# Altium schematic sheet fullCURRENT smarts comms.SchDoc
size C
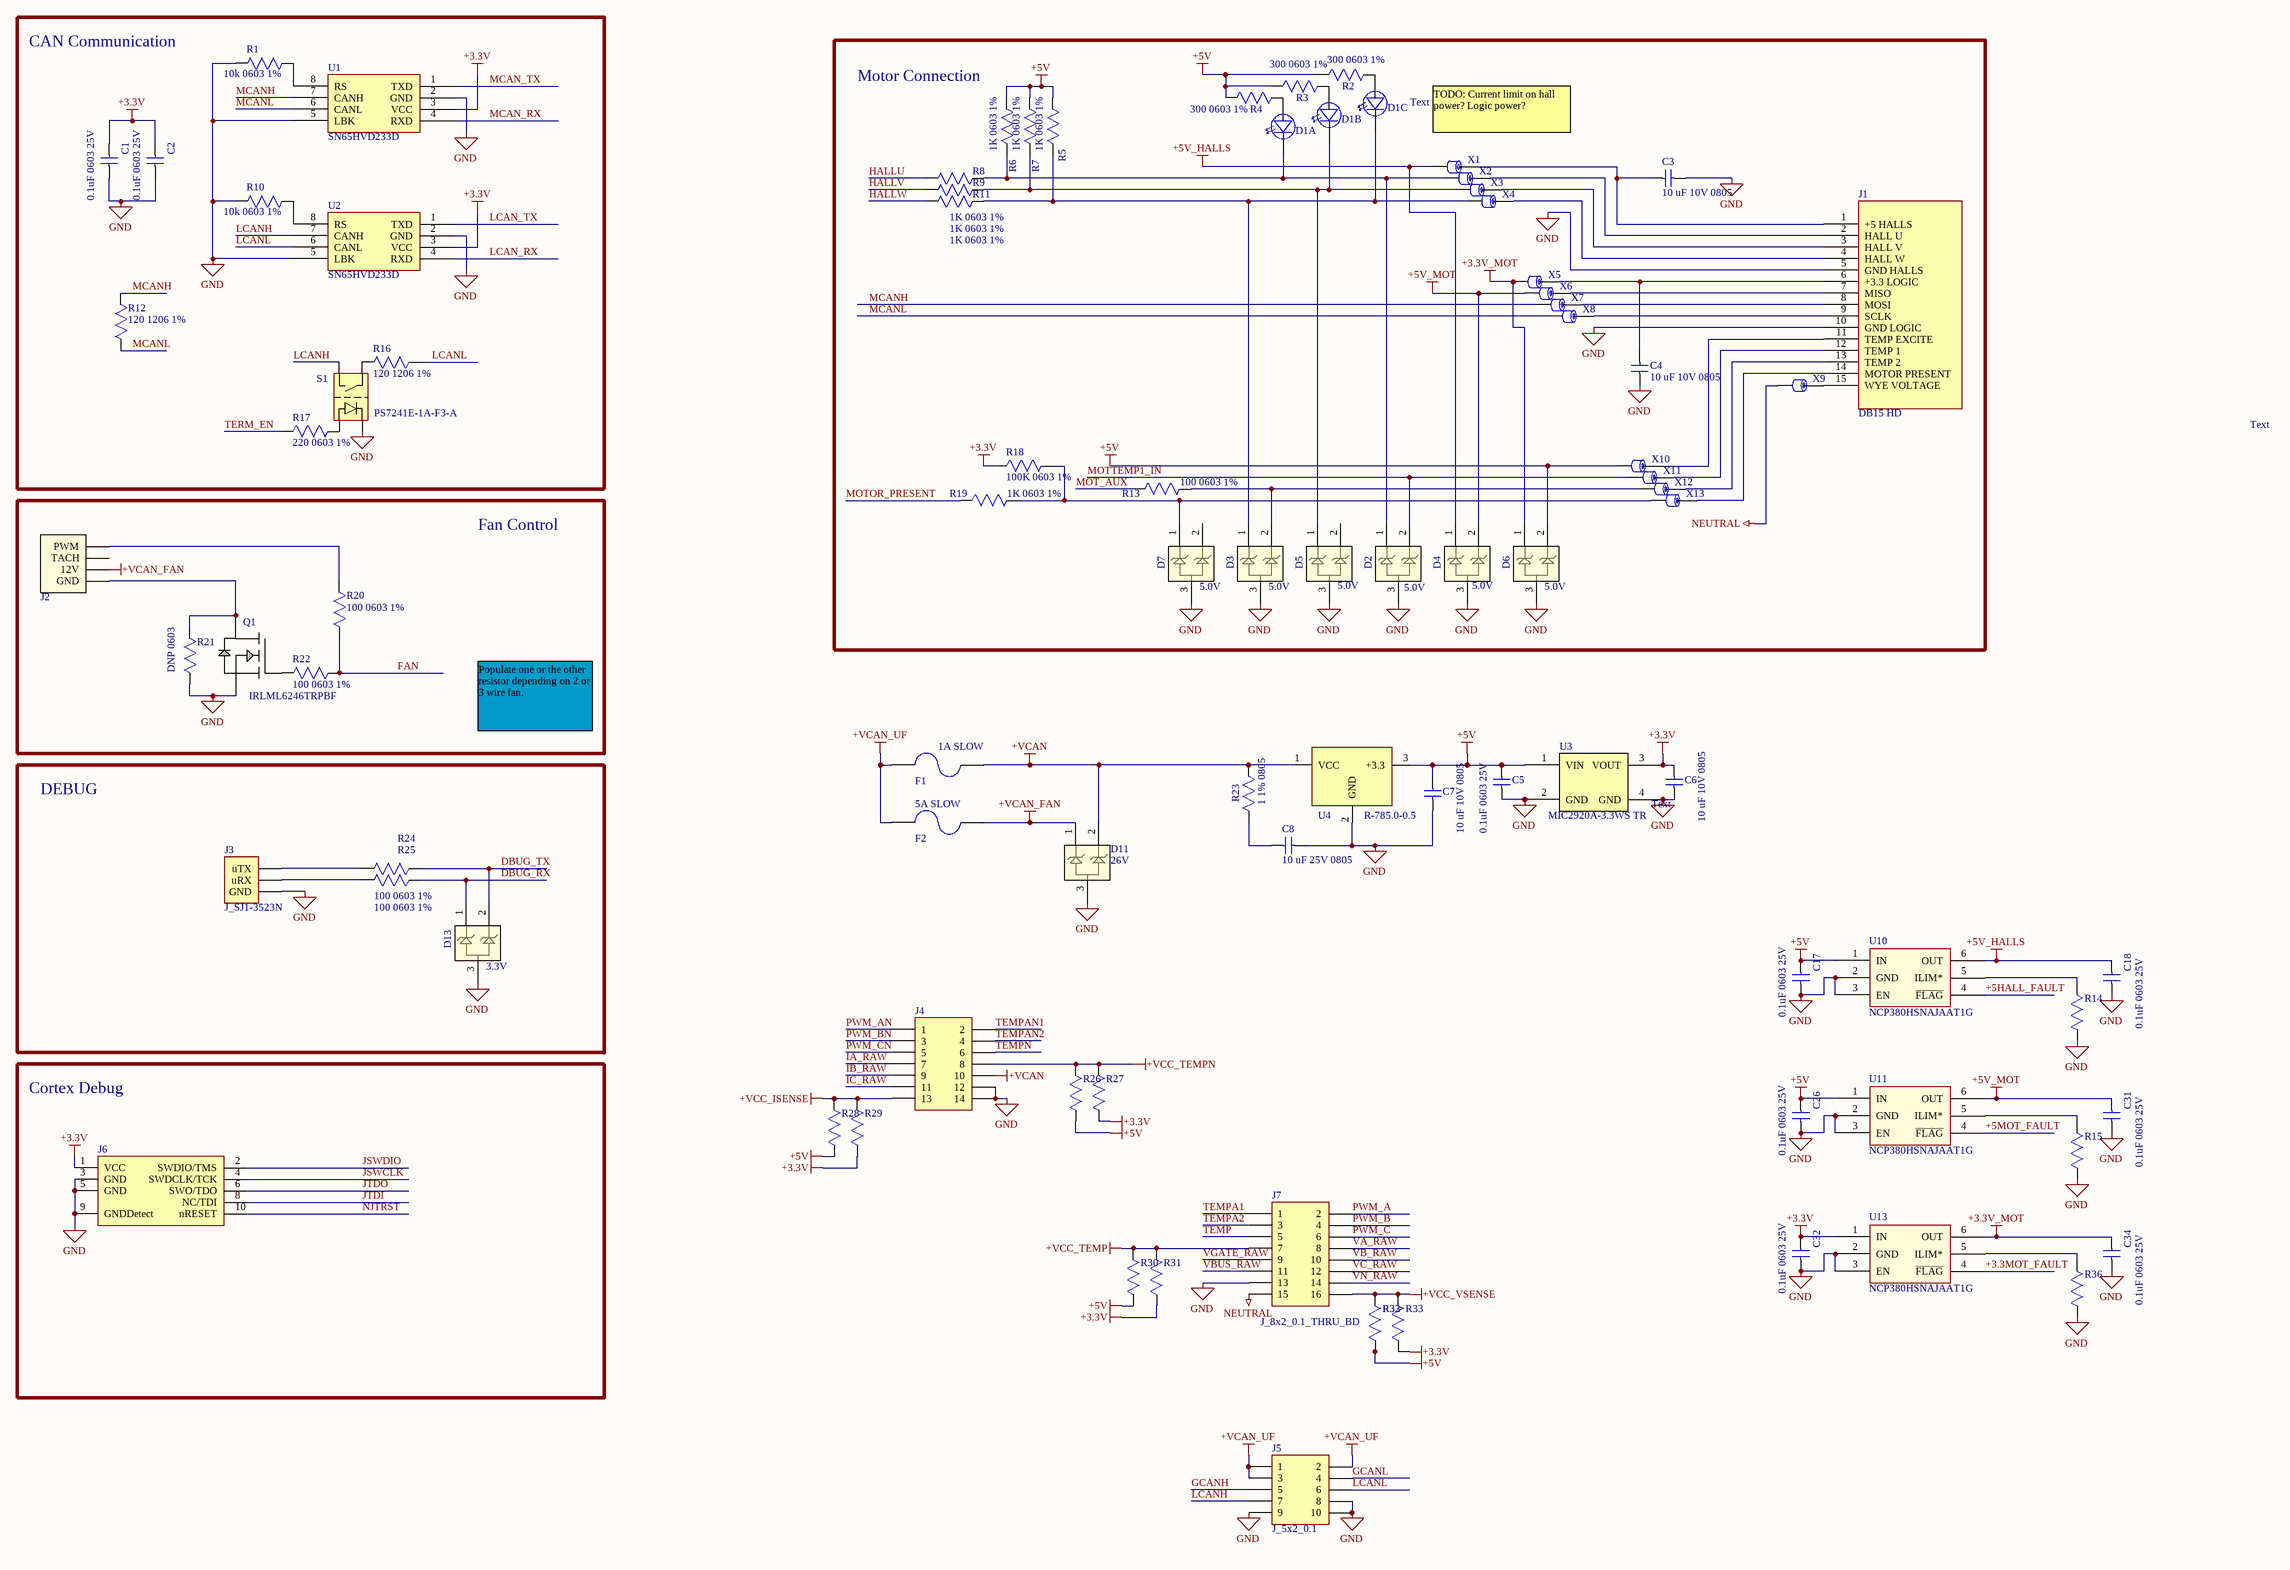
[diagram p0: fullCURRENT smarts comms.SchDoc]

## Parts
(Parts that share a designator on the sheet are numbered #1, #2 ... from top to bottom, then left to right.)
C1  value 0.1uF 0603 25V  [0603_cap]  (hidden comment: CAP 0603)
C2  value 0.1uF 0603 25V  [0603_cap]  (hidden comment: CAP 0603)
C3  value 10 uF 10V 0805  [0805_Capacitor]  (hidden comment: CAP 0805)
C4  value 10 uF 10V 0805  [0805_Capacitor]  (hidden comment: CAP 0805)
C5  value 0.1uF 0603 25V  [0603_cap]  (hidden comment: CAP 0603)
C6  value 10 uF 10V 0805  [0805_Capacitor]  (hidden comment: CAP 0805)
C7  value 10 uF 10V 0805  [0805_Capacitor]  (hidden comment: CAP 0805)
C8  value 10 uF 25V 0805  [0805_Capacitor]  (hidden comment: CAP 10 uF 25V 0805)
C17  value 0.1uF 0603 25V  [0603_cap]  (hidden comment: CAP 0603)
C18  value 0.1uF 0603 25V  [0603_cap]  (hidden comment: CAP 0603)
C26  value 0.1uF 0603 25V  [0603_cap]  (hidden comment: CAP 0603)
C31  value 0.1uF 0603 25V  [0603_cap]  (hidden comment: CAP 0603)
C32  value 0.1uF 0603 25V  [0603_cap]  (hidden comment: CAP 0603)
C34  value 0.1uF 0603 25V  [0603_cap]  (hidden comment: CAP 0603)
D1  D_LED_3HIGH_BLUE  [DIALIGHT 564]  (value not drawn)  (parts A,B,C of 3)
D2  5.0V  [SOT-23]
D3  5.0V  [SOT-23]
D4  5.0V  [SOT-23]
D5  5.0V  [SOT-23]
D6  5.0V  [SOT-23]
D7  5.0V  [SOT-23]
D11  26V  [SOT-23]
D13  3.3V  [SOT-23]
F1  Current Rating: 1A SLOW  [2410]  (hidden comment: F_2410)
F2  Current Rating: 5A SLOW  [2410]  (hidden comment: F_2410)
J1  DB15 HD  [DB15HDF_RA]
J2  J_4 Wire Fan Connector  [0901361204]  (value not drawn)
J3  J_SJ1-3523N  [SJ1-3523N]
J4  J_7x2_0.1_THRU_BD  [HLE-107-02-X-DV]  (value not drawn)
J5  J_5x2_0.1  [10PIN_2_.100IN]
J6  J_CORTEX_DEBUG  [CORTEX_DEBUG]  (value not drawn)
J7  J_8x2_0.1_THRU_BD  [HLE-108-02-X-DV]
Q1  Part Number: IRLML6246TRPBF  [SOT-23]  (hidden comment: Q_IRLML6246TRPBF)
R1  value 10k 0603 1%  [0603_res]  (hidden comment: RES 0603)
R2  value 300 0603 1%  [0603_res]  (hidden comment: RES 0603)
R3  value 300 0603 1%  [0603_res]  (hidden comment: RES 0603)
R4  value 300 0603 1%  [0603_res]  (hidden comment: RES 0603)
R5  value 1K 0603 1%  [0603_res]  (hidden comment: RES 0603)
R6  value 1K 0603 1%  [0603_res]  (hidden comment: RES 0603)
R7  value 1K 0603 1%  [0603_res]  (hidden comment: RES 0603)
R8  value 1K 0603 1%  [0603_res]  (hidden comment: RES 0603)
R9  value 1K 0603 1%  [0603_res]  (hidden comment: RES 0603)
R10  value 10k 0603 1%  [0603_res]  (hidden comment: RES 0603)
R11  value 1K 0603 1%  [0603_res]  (hidden comment: RES 0603)
R12  value 120 1206 1%  [1206_Resistor]  (hidden comment: RES 1206)
R13  value 100 0603 1%  [0603_res]  (hidden comment: RES 0603)
R14  RES 0603  [0603_res]  (value not drawn)
R15  RES 0603  [0603_res]  (value not drawn)
R16  value 120 1206 1%  [1206_Resistor]  (hidden comment: RES 1206)
R17  value 220 0603 1%  [0603_res]  (hidden comment: RES 0603)
R18  value 100K 0603 1%  [0603_res]  (hidden comment: RES 0603)
R19  value 1K 0603 1%  [0603_res]  (hidden comment: RES 0603)
R20  value 100 0603 1%  [0603_res]  (hidden comment: RES 0603)
R21  value DNP 0603  [0603_res]  (hidden comment: RES 0603)
R22  value 100 0603 1%  [0603_res]  (hidden comment: RES 0603)
R23  value 1 1% 0805  [0805_Resistor]  (hidden comment: R_0805_1_1%)
R24  value 100 0603 1%  [0603_res]  (hidden comment: RES 0603)
R25  value 100 0603 1%  [0603_res]  (hidden comment: RES 0603)
R26  RES 0603  [0603_res]  (value not drawn)
R27  RES 0603  [0603_res]  (value not drawn)
R28  RES 0603  [0603_res]  (value not drawn)
R29  RES 0603  [0603_res]  (value not drawn)
R30  RES 0603  [0603_res]  (value not drawn)
R31  RES 0603  [0603_res]  (value not drawn)
R32  RES 0603  [0603_res]  (value not drawn)
R33#1  RES 0603  [0603_res]  (value not drawn)
R33#2  RES 0603  [0603_res]  (value not drawn)
R36  RES 0603  [0603_res]  (value not drawn)
S1  Part Number: PS7241E-1A-F3-A  [4SOP-GULL]  (hidden comment: S_PS7241E-1A-F3-A)
U1  Part Number: SN65HVD233D  [SOIC127P600X175-8N]  (hidden comment: U_SN65HVD233D)
U2  Part Number: SN65HVD233D  [SOIC127P600X175-8N]  (hidden comment: U_SN65HVD233D)
U3  Part Number: MIC2920A-3.3WS TR  [SOT-223]  (hidden comment: U_MIC2920A-3.3WS)
U4  R-785.0-0.5  [SIP3]
U10  NCP380HSNAJAAT1G  [tsop-6]
U11  NCP380HSNAJAAT1G  [TSOP-6]
U13  NCP380HSNAJAAT1G  [TSOP-6]
X1  0603  [0603_res]  (value not drawn)
X2  0603  [0603_res]  (value not drawn)
X3  0603  [0603_res]  (value not drawn)
X4  0603  [0603_res]  (value not drawn)
X5  0603  [0603_res]  (value not drawn)
X6  0603  [0603_res]  (value not drawn)
X7  0603  [0603_res]  (value not drawn)
X8  0603  [0603_res]  (value not drawn)
X9  0603  [0603_res]  (value not drawn)
X10  0603  [0603_res]  (value not drawn)
X11  0603  [0603_res]  (value not drawn)
X12  0603  [0603_res]  (value not drawn)
X13  0603  [0603_res]  (value not drawn)

## Blocks framed on the sheet
CAN Communication: C1 C2 R1 R10 R12 R16 R17 S1 U1 U2
Motor Connection: C3 C4 D1-D7 J1 R2-R9 R11 R13 R18 R19 X1-X13
Fan Control: J2 Q1 R20-R22
DEBUG: D13 J3 R24 R25
Cortex Debug: J6

## Nets
+3.3V: C1.2 C2.2 C6.2 C32.2 J6.1(VCC) R18.2 R27.1 R29.1 R31.1 R33#2.1 U1.3(VCC) U2.3(VCC) U3.3(VOUT) U13.1(IN)
+3.3V_MOT: C34.2 D6.1 U13.6(OUT) X5.1
+5V: C5.2 C7.2 C17.2 C26.2 D6.2 R2.2 R3.2 R4.2 R5.1 R6.1 R7.1 R26.1 R28.1 R30.1 R32.1 R33#1.1 U3.1(VIN) U4.3(+3.3) U10.1(IN) U11.1(IN) X10.1
+5V_HALLS: C18.2 D4.1 U10.6(OUT) X1.1
+5V_MOT: C31.2 D4.2 U11.6(OUT) X6.1
+VCAN: D11.2 F1.2 J4.10 R23.1 U4.1(VCC)
+VCAN_FAN: D11.1 F2.2 J2.2(12V)
+VCAN_UF: F1.1 F2.1 J5.1 J5.2 J5.3
+VCC_ISENSE: J4.13 R28.2 R29.2
+VCC_TEMP: J7.7 R30.2 R31.2
+VCC_TEMPN: J4.8 R26.2 R27.2
+VCC_VSENSE: J7.16 R32.2 R33#1.2 R33#2.2
GND: C1.1 C2.1 C3.2 C4.2 C5.1 C6.1 C7.1 C8.2 C17.1 C18.1 C26.1 C31.1 C32.1 C34.1 D2.3 D3.3 D4.3 D5.3 D6.3 D7.3 D11.3 D13.3 J1.5(GND_HALLS) J1.10(GND_LOGIC) J3.GND J4.12 J4.14 J5.8 J5.9 J5.10 J6.3(GND) J6.5(GND) J6.9(GNDDetect) J7.13 Q1.2(SOURCE) R1.1 R10.1 R14.1 R15.1 R21.2 R36.1 S1.2 U1.2(GND) U1.5(LBK) U2.2(GND) U2.5(LBK) U3.2(GND) U3.4(GND) U4.2(GND) U10.2(GND) U10.3(EN) U11.2(GND) U11.3(EN) U13.2(GND) U13.3(EN)
NEUTRAL: J7.15 X9.1
+3.3MOT_FAULT: U13.4(~{FLAG})
+5HALL_FAULT: U10.4(~{FLAG})
+5MOT_FAULT: U11.4(~{FLAG})
DBUG_RX: D13.1 R25.2
DBUG_TX: D13.2 R24.2
FAN: R20.2 R22.2
GCANH: J5.5
GCANL: J5.4
HALLU: R8.1
HALLV: R9.1
HALLW: R11.1
IA_RAW: J4.7
IB_RAW: J4.9
IC_RAW: J4.11
JSWCLK: J6.4(SWDCLK/TCK)
JSWDIO: J6.2(SWDIO/TMS)
JTDI: J6.8(NC/TDI)
JTDO: J6.6(SWO/TDO)
LCAN_RX: U2.4(RXD)
LCAN_TX: U2.1(TXD)
LCANH: J5.7 S1.4 U2.7(CANH)
LCANL: J5.6 R16.2 U2.6(CANL)
MCAN_RX: U1.4(RXD)
MCAN_TX: U1.1(TXD)
MCANH: R12.1 U1.7(CANH) X7.1
MCANL: R12.2 U1.6(CANL) X8.1
MOT_AUX: R13.2
MOTOR_PRESENT: R19.2
MOTTEMP1_IN: D2.2 X11.1
NJTRST: J6.10(nRESET)
PWM_A: J7.2
PWM_AN: J4.1
PWM_B: J7.4
PWM_BN: J4.3
PWM_C: J7.6
PWM_CN: J4.5
TEMP: J7.5
TEMPA1: J7.1
TEMPA2: J7.3
TEMPAN1: J4.2
TEMPAN2: J4.4
TEMPN: J4.6
TERM_EN: R17.2
VA_RAW: J7.8
VB_RAW: J7.10
VBUS_RAW: J7.11
VC_RAW: J7.12
VGATE_RAW: J7.9
VN_RAW: J7.14
NetC3_1: C3.1 J1.1(+5_HALLS) X1.2
NetC4_1: C4.1 J1.6(+3.3_LOGIC) X5.2
NetC8_1: C8.1 R23.2
NetD1_1: D1.1(Cathode) D2.1 R6.2 R8.2 X2.1
NetD1_2: D1.2(Anode) R4.1
NetD1_3: D1.3(Cathode) D5.1 R7.2 R9.2 X3.1
NetD1_4: D1.4(Anode) R3.1
NetD1_5: D1.5(Cathode) D3.1 R5.2 R11.2 X4.1
NetD1_6: D1.6(Anode) R2.1
NetD3_2: D3.2 R13.1 X12.1
NetD7_1: D7.1 R18.1 R19.1 X13.1
NetJ1_2: J1.2(HALL_U) X2.2
NetJ1_3: J1.3(HALL_V) X3.2
NetJ1_4: J1.4(HALL_W) X4.2
NetJ1_7: J1.7(MISO) X6.2
NetJ1_8: J1.8(MOSI) X7.2
NetJ1_9: J1.9(SCLK) X8.2
NetJ1_11: J1.11(TEMP_EXCITE) X10.2
NetJ1_12: J1.12(TEMP_1) X11.2
NetJ1_13: J1.13(TEMP_2) X12.2
NetJ1_14: J1.14(MOTOR_PRESENT) X13.2
NetJ1_15: J1.15(WYE_VOLTAGE) X9.2
NetJ2_1: J2.1(GND) Q1.3(DRAIN) R21.1
NetJ2_4: J2.4(PWM) R20.1
NetJ3_uRX: J3.uRX R25.1
NetJ3_uTX: J3.uTX R24.1
NetQ1_1: Q1.1(GATE) R22.1
NetR1_2: R1.2 U1.8(RS)
NetR10_2: R10.2 U2.8(RS)
NetR14_2: R14.2 U10.5(ILIM*)
NetR15_2: R15.2 U11.5(ILIM*)
NetR16_1: R16.1 S1.3
NetR17_1: R17.1 S1.1
NetR36_2: R36.2 U13.5(ILIM*)

Not connected (* = marked no-connect by the designer): D5 2; D7 2; J2 3(TACH)

## Notes on the sheet
- Text
- TODO: Current limit on hall power? Logic power?
- Populate one or the other resistor depending on 2 or 3 wire fan.
- (near C6) Text

## Library data of the parts
C1 C2 C5 C17 C18 C26 C31 C32 C34 = C_0603: CAP CERM 0.1uF 0603 X7R; Supplier 1: Digi-Key; Supplier Part Number 1: 490-1524-1-ND
  C5: Known Distributors: Digikey; Package: 0603
C3 C4 C6 C7 = C_0805: CAP CERM 0805; Supplier 1: Digi-Key; Supplier Part Number 1: 587-1300-1-ND
C8 = C_0805: CAP CERM 10 uF 25V 0805; Supplier 1: Digi-Key; Supplier Part Number 1: 587-2985-2-ND
D1 = D_LED_3HIGH_BLUE: LED 3MM TRI-LEVEL HI-EFF BLUE; Part Number: 564-0100-999F; Manufacturer: Dialight; Supplier 1: Digi-Key; Supplier Part Number 1: 350-1852-ND
D2 D3 D6 D7 = D_TVS_5: 5.0V TVS SOT23; Supplier 1: Digi-Key; Supplier Part Number 1: 641-1198-1-ND
D4 D5 = D_TVS_3_3: 5.0V TVS SOT23; Supplier 1: Digi-Key; Supplier Part Number 1: 641-1198-1-ND
D11 = D_TVS_12V: Supplier 1: Digi-Key; Supplier Part Number 1: MMBZ33VAL-FDICT-ND
D13 = D_TVS_5: 3.3V TVS SOT23; Supplier 1: Digi-Key
F1 F2 = F_2410: FUSE 2410; Package: 2410; Supplier 1: Digi-Key
  F1: Supplier Part Number 1: 507-1186-1-ND
  F2: Supplier Part Number 1: 507-1194-1-ND
J1 = J_DB15_HD_F_RA_MOTOR: Supplier 1: Digi-Key; Supplier Part Number 1: A35116-ND
J2 = J_4 Wire Fan Connector: 4 Wire Fan Connector; Supplier 1: Digi-Key; Part Number: 0901361204
J3 = J_SJ1-3523N: CONN JACK STEREO R/A 3PIN 3.5MM; Manufacturer: CUI; Part Number: SJ1-3523N
J4 = J_7x2_0.1_THRU_BD: 7 x 2 0.1" Header; Part Number: HLE-107-02-L-DV-BE; Manufacturer: Samtec; Supplier Part Number 1: HLE-107-02-L-DV-BE; Supplier 1: Samtec
J5 = J_5x2_0.1: 5 x 2 0.1" Header; Part Number: TST-105-01-F-D; Manufacturer: Samtec; Supplier 1: Digi-Key; Supplier Part Number 1: S9169-ND
J6 = J_CORTEX_DEBUG: CORTEX JTAG DEBUG CONNECTOR; Part Number: FTSH-105-01-F-D; Manufacturer: Samtec; Supplier 1: Samtec; Supplier Part Number 1: FTSH-105-01-F-D
J7 = J_8x2_0.1_THRU_BD: 8 x 2 0.1" Header; Part Number: HLE-108-02-F-DV-PE-BE; Manufacturer: Samtec; Supplier Part Number 1: HLE-108-02-F-DV-PE-BE; Supplier 1: Samtec
Q1 = Q_IRLML6246TRPBF: MOSFET N-CH 20V 4.1A SOT-23; Manufacturer: Alpha & Omega; Supplier 1: Digi-Key; Supplier Part Number 1: IRLML6246TRPBFCT-ND
R1 R10 = R_0603: RES 10K 0603 1%; Supplier 1: Digi-Key; Supplier Part Number 1: 311-10.0KHRCT-ND
R2-R4 = R_0603: RES 300 0603 1%; Supplier 1: Digi-Key; Supplier Part Number 1: 311-300HRCT-ND
R5-R9 R11 R19 = R_0603: RES 1K 0603 1%; Supplier 1: Digi-Key; Supplier Part Number 1: 311-1.00KHRCT-ND
R12 R16 = R_1206: RES 120 1206 1%; Package: 1206; Supplier 1: Digi-Key; Supplier Part Number 1: 311-120FRCT-ND
R13 R20 R22 R24 R25 = R_0603: RES 100 0603 1%; Supplier 1: Digi-Key
  R13 R20 R22: Supplier Part Number 1: 311-100HRCT-ND
R14 R15 R26-R32 R33#1 R33#2 R36 = R_0603: Known Distributors: Digikey; Package: 0603
R17 = R_0603: RES 220 0603 1%; Manufacturer: Yageo; Part Number: RC0603FR-07220RL; Package: 0603; Supplier 1: Digi-Key; Supplier Part Number 1: 311-220GRCT-ND
R18 = R_0603: RES 100K 0603 1%; Supplier 1: Digi-Key; Supplier Part Number 1: 311-100KHRCT-ND
R21 = R_0603: RES DNP 0603 1%
R23 = R_0805_1_1%: RES 1 OHM 1/8W 1% 0805 SMD; Power Rating: .125W; Package: 0805; Supplier 1: Digi-Key; Supplier Part Number 1: RHM1.00CICT-ND
S1 = S_PS7241E-1A-F3-A: SSR OCMOS FET 120MA 1CH NO 4-SOP; Manufacturer: CEL; Supplier 1: Digi-Key; Supplier Part Number 1: PS7241E-1ACT-ND
U1 U2 = U_SN65HVD233D: IC 3.3V CAN TXRX 8-SOIC; Manufacturer: Texas Instruments; Supplier 1: Digi-Key; Supplier Part Number 1: 296-14639-5-ND
U3 = U_MIC2920A-3.3WS: IC REG LDO 3.3V .4A SOT223; Manufacturer: Mircrel; Supplier 1: Digi-Key; Supplier Part Number 1: 576-1116-1-ND
U4 = U_R-783.3-0.5: IC REG 0.5A 5.0V; Manufacturer: Recom Power; Part Number: R-785.0-0.5; Supplier 1: Digi-Key; Supplier Part Number 1: 945-1037-ND
U10 U11 U13 = U_NCP380HSNAJAAT1G: IC CURRENT LIMIT SWITCH 6-TSOP; Manufacturer: ON Semiconductor; Part Number: NCP380HSNAJAAT1G
X1-X13 = X_0603_FERRITE: FERRITE 0603; Supplier 1: Digi-Key; Supplier Part Number 1: 445-2205-2-ND